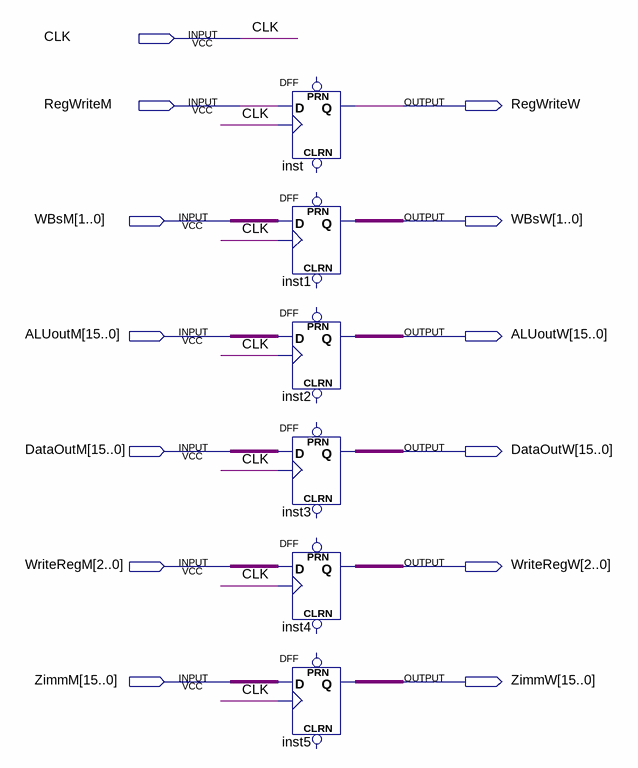
[diagram p0: schematic sheet]
// Quartus schematic M_W.bdf as structural Verilog: 6 symbols, 13 pins
module M_W (
  input  CLK,
  input  RegWriteM,
  input  [1:0] WBsM,
  input  [15:0] ALUoutM,
  input  [15:0] DataOutM,
  input  [2:0] WriteRegM,
  input  [15:0] ZimmM,
  output RegWriteW,
  output [1:0] WBsW,
  output [15:0] ALUoutW,
  output [15:0] DataOutW,
  output [2:0] WriteRegW,
  output [15:0] ZimmW
);

  DFF inst (.CLK(CLK), .D(RegWriteM), .Q(RegWriteW));  // open: CLRN, PRN
  DFF inst1[1:0] (.CLK(CLK), .D(WBsM), .Q(WBsW));  // open: CLRN, PRN
  DFF inst2[15:0] (.CLK(CLK), .D(ALUoutM), .Q(ALUoutW));  // open: CLRN, PRN
  DFF inst3[15:0] (.CLK(CLK), .D(DataOutM), .Q(DataOutW));  // open: CLRN, PRN
  DFF inst4[2:0] (.CLK(CLK), .D(WriteRegM), .Q(WriteRegW));  // open: CLRN, PRN
  DFF inst5[15:0] (.CLK(CLK), .D(ZimmM), .Q(ZimmW));  // open: CLRN, PRN
endmodule
